# EAGLE design POMORODO Timer (EAGLE 6.4)
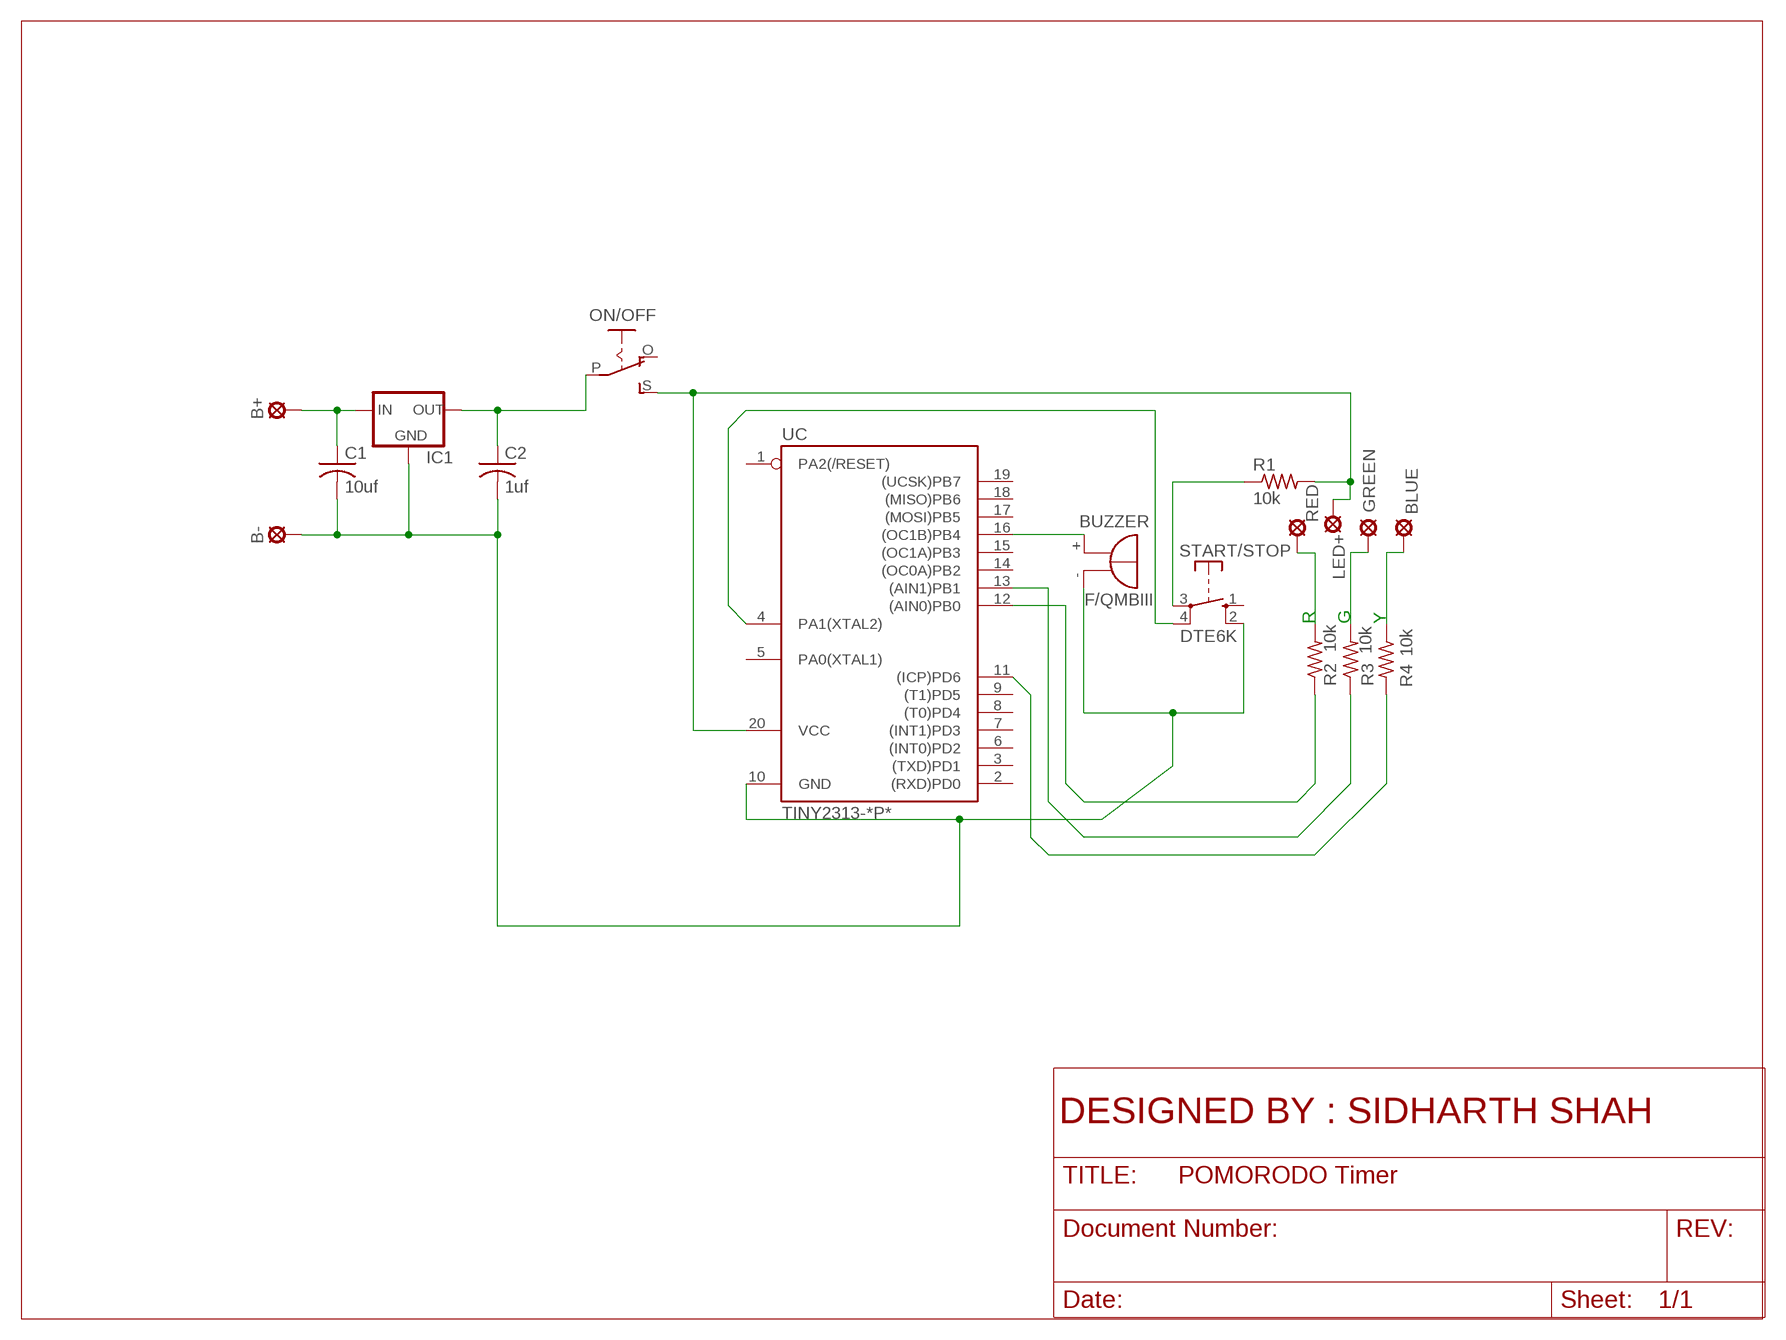
[diagram p0: schematic, sheet 1]

## Parts
B+  SE14  [SE14]
B-  SE14  [SE14]
BLUE  SE14  [SE14]
BUZZER  F/QMBIII  [F/QMBIII]
C1  10uf  C-US025-025X050  [C025-025X050]
C2  1uf  C-US025-025X050  [C025-025X050]
GREEN  SE14  [SE14]
IC1  7805  [TO220LV]
LED+  SE14  [SE14]
ON/OFF  EG1218S  [EG1218]
R1  10k  R-US_0207/10  [0207/10]
R2  10k  R-US_0207/10  [0207/10]
R3  10k  R-US_0207/10  [0207/10]
R4  10k  R-US_0207/10  [0207/10]
RED  SE14  [SE14]
START/STOP  DTE6K  [DTE6K]
UC  TINY2313-*P*  [DIL20]

## Nets
GND: B-.MP BUZZER.-(+) C1.2 C2.2 IC1.2(GND) START/STOP.2(S) UC.10(GND)
INPUT: START/STOP.4(P) UC.4(PA1(XTAL2))
N$1: R2.2 RED.MP
N$2: GREEN.MP R3.2
N$3: BLUE.MP R4.1
N$4: R2.1 UC.12((AIN0)PB0)
N$5: R3.1 UC.13((AIN1)PB1)
N$6: R1.1 START/STOP.3(P)
N$7: BUZZER.+(-) UC.16((OC1B)PB4)
N$8: C2.1 IC1.3(OUT) ON/OFF.P
N$9: R4.2 UC.11((ICP)PD6)
N$10: LED+.MP ON/OFF.S R1.2 UC.20(VCC)
N$12: B+.MP C1.1 IC1.1(IN)
Unconnected: ON/OFF.O START/STOP.1(S) UC.1(PA2(/RESET)) UC.2((RXD)PD0) UC.3((TXD)PD1) UC.5(PA0(XTAL1)) UC.6((INT0)PD2) UC.7((INT1)PD3) UC.8((T0)PD4) UC.9((T1)PD5) UC.14((OC0A)PB2) UC.15((OC1A)PB3) UC.17((MOSI)PB5) UC.18((MISO)PB6) UC.19((UCSK)PB7)

## Notes on the sheet
- R | G | Y
- DESIGNED BY : SIDHARTH SHAH

## Library data of the parts
B+ B- BLUE GREEN LED+ RED = solpad:SE14: SOLDER PAD E1553, drill 1,4mm, distributor Buerklin, 07F820
BUZZER = buzzer:F/QMBIII: BUZZER Source: Buerklin; OC_FARNELL: unknown; OC_NEWARK: unknown
C1 C2 = rcl:C-US: CAPACITOR, American symbol
IC1 = EE401-Revised:7805
ON/OFF = adafruit:EG1218: SLIDING SWITCH 0.1" spacing through hole, vertical SPDT slide switch http://www.ladyada.net/library/pcb/eaglelibrary.html
R1-R4 = resistor:R-US_: RESISTOR, American symbol
START/STOP = switch-misc:DT: ITT SWITCH
UC = avr-6:TINY2313*: Atmel Tiny2313 2K Flash, 128 bytes EEPROM, 128 bytes RAM

## Board
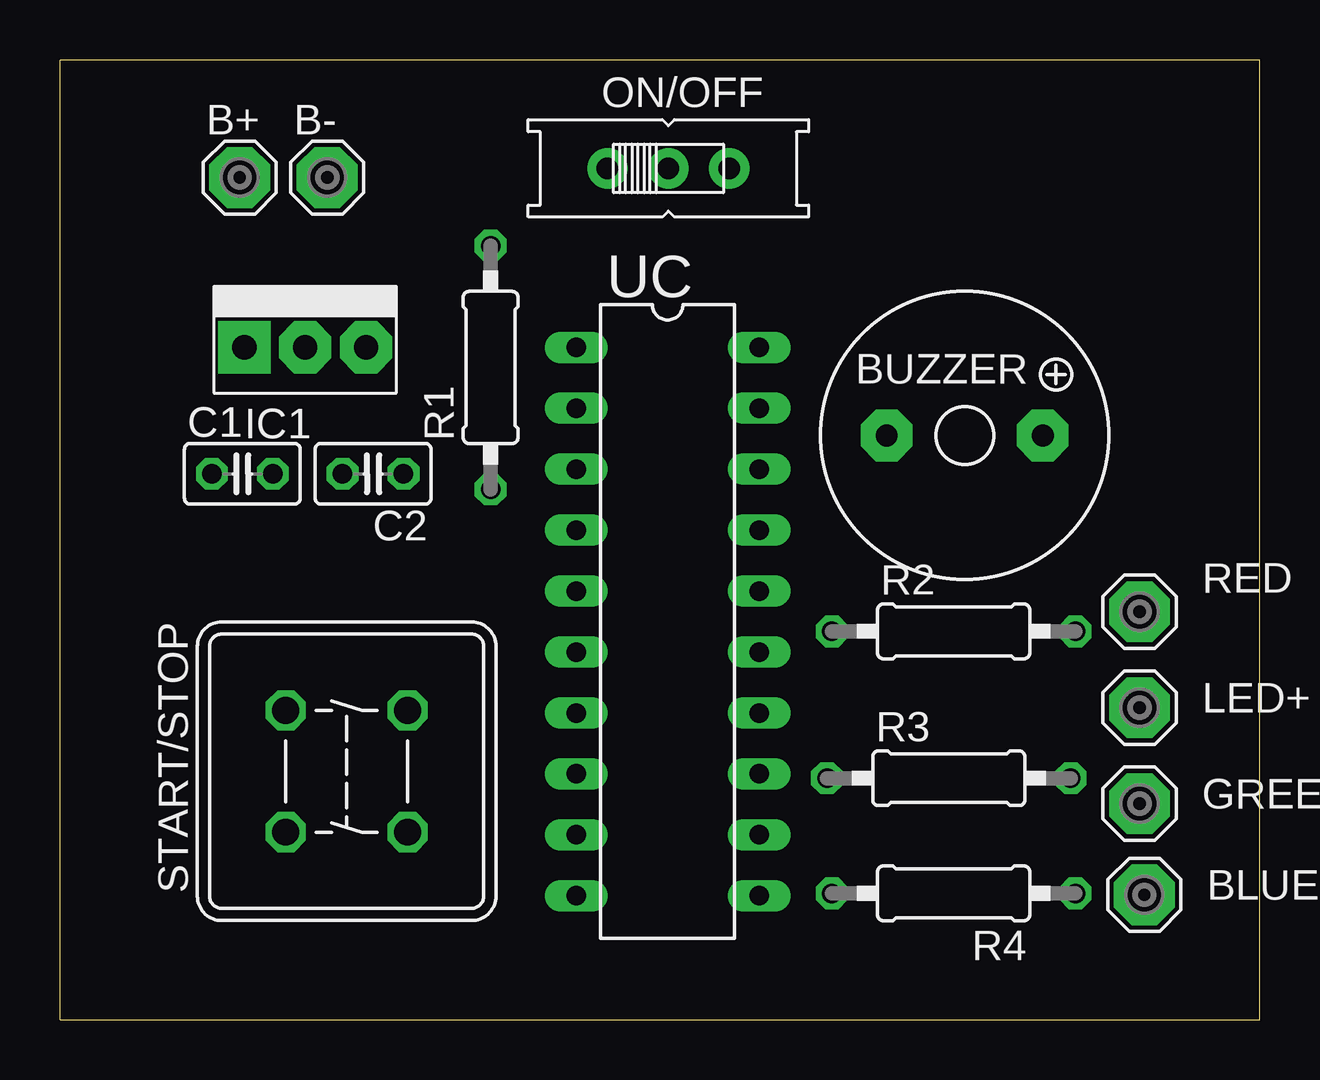
[diagram p1: board, top side]
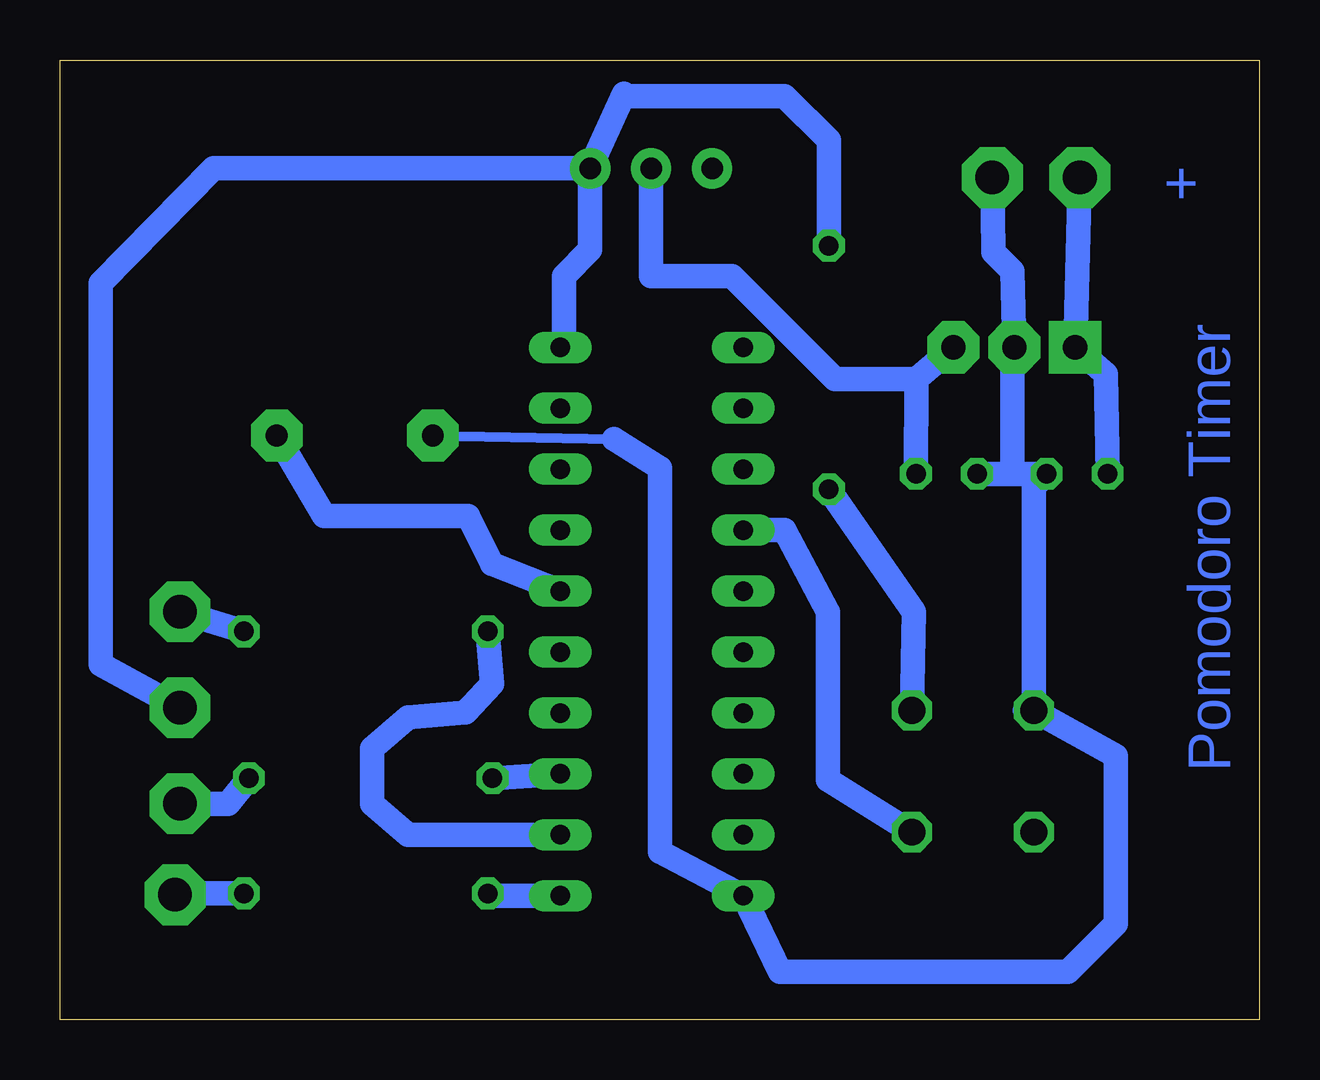
[diagram p2: board, bottom side, seen from below]

Size 50 x 40 mm. Coordinates in mm from the lower left corner, seen from the top.
Outline: 0,0 50,0 50,40 0,40 0,0
Copper layers (1*16): Top 0.035mm / dielectric 1.5mm / Bottom 0.035mm
Design rules "working_timer_oankar Silver circiut": minimum track width 7mil, minimum drill 15mil, track to track 7mil, track to pad 7mil, pad to pad 7mil, via to via 7mil, smd to smd 7mil, copper to edge 20mil, drill to drill 8mil, minimum pad ring 10mil, minimum via ring 8mil, stop-mask expansion 3mil, vias tented up to drill 0mil, thermal gap 10mil

### Footprints (pad centres in the part's own frame; a part is rotated, then mirrored left to right if it is on the bottom)
SE14 = drill 1.397 pad 2.54 octagon: MP 0,0
F/QMBIII = drill 0.914 pad 2.159 octagon: + 3.251,0; - -3.251,0
C025-025X050 = drill 0.813 octagon: 1 -1.27,0; 2 1.27,0
TO220LV = drill 1.016 pad 2.184 square: 1 0,0 | drill 1.016 pad 2.184 octagon: 2 2.54,0; 3 5.08,0
EG1218 = drill 0.9 pad 1.676: O -2.54,0; P 0,0; S 2.54,0
0207/10 = drill 0.813 octagon: 1 -5.08,0; 2 5.08,0
DTE6K = drill 1.118 octagon: 1 -2.54,2.54; 2 2.54,2.54; 3 2.54,-2.54; 4 -2.54,-2.54
DIL20 = drill 0.813 long: 1 -11.43,-3.81; 2 -8.89,-3.81; 3 -6.35,-3.81; 4 -3.81,-3.81; 5 -1.27,-3.81; 6 1.27,-3.81; 7 3.81,-3.81; 8 6.35,-3.81; 9 8.89,-3.81; 10 11.43,-3.81; 11 11.43,3.81; 12 8.89,3.81; 13 6.35,3.81; 14 3.81,3.81; 15 1.27,3.81; 16 -1.27,3.81; 17 -3.81,3.81; 18 -6.35,3.81; 19 -8.89,3.81; 20 -11.43,3.81

### Placement (x,y rotation side)
B+  7.49,35.1 0 top
B-  11.14,35.1 0 top
BLUE  45.2,5.2 0 top
BUZZER  37.71,24.35 0 top
C1  7.6,22.75 0 top
C2  13.05,22.75 180 top
GREEN  45,9 0 top
IC1  7.68,28.02 0 top
LED+  45,13 0 top
ON/OFF  25.36,35.48 0 top
R1  17.95,27.18 90 top
R2  37.25,16.18 0 top
R3  37.05,10.06 0 top
R4  37.25,5.26 180 top
RED  45,17 0 top
START/STOP  11.95,10.35 90 top
UC  25.33,16.59 270 top

### Tracks (layer width: path | path; a pad name or v marks a point on that pad's centre or on a via)
GND
  Bottom 0.406: BUZZER.- 26.9,24.2
  Bottom 0.813: START/STOP.2 9.89,12.89
  Bottom 1.016: 26.9,24.2 25,23 25,7 UC.10 20,2 8,2 6,4 6,11 START/STOP.2 9.41,22.21 C1.2 10.3,22.75 | B-.MP 11.1,32 10.3,31.2 IC1.2 10.3,28.02 10.3,22.75 | 10.3,22.75 C2.2
INPUT
  Bottom 1.016: START/STOP.4 18,10 18,17 19.8,20.4 UC.4
N$1
  Bottom 1.016: R2.2 RED.MP
N$2
  Bottom 1.016: R3.2 43,9 GREEN.MP
N$3
  Bottom 0.406: 45.2,5.26 BLUE.MP
  Bottom 1.016: R4.1 45.2,5.26
N$4
  Bottom 1.016: UC.12 35.5,7.7 37,9 37,11.3 35.5,12.6 33.1,12.8 32,14 R2.1
N$5
  Bottom 1.016: UC.13 R3.1
N$6
  Bottom 1.016: START/STOP.3 14.4,17 R1.1
N$7
  Bottom 1.016: UC.16 32,19 33,21 39,21 BUZZER.+
N$8
  Bottom 1.016: IC1.3 14.3,26.7 | 14.3,26.7 C2.1 | 14.3,26.7 17.7,26.7 22,31 25.36,31 ON/OFF.P
N$9
  Bottom 0.178: R4.2 31.75,5.08 31.75,5.16
  Bottom 1.016: UC.11 31.75,5.16 32.17,5.16
N$10
  Bottom 1.016: LED+.MP 48.3,14.8 48.3,30.7 43.6,35.5 35.3,35.5 ON/OFF.S | ON/OFF.S 26.5,38.6 26.4,38.5 19.8,38.5 17.95,36.65 R1.2 | ON/OFF.S 27.9,32.1 29,31 29,28.16 UC.20
N$12
  Bottom 1.016: B+.MP IC1.1 6.4,26.9 C1.1

### Text on the board
Bottom: + | Pomodoro Timer